# Altium schematic sheet DDR3.SchDoc
size A4
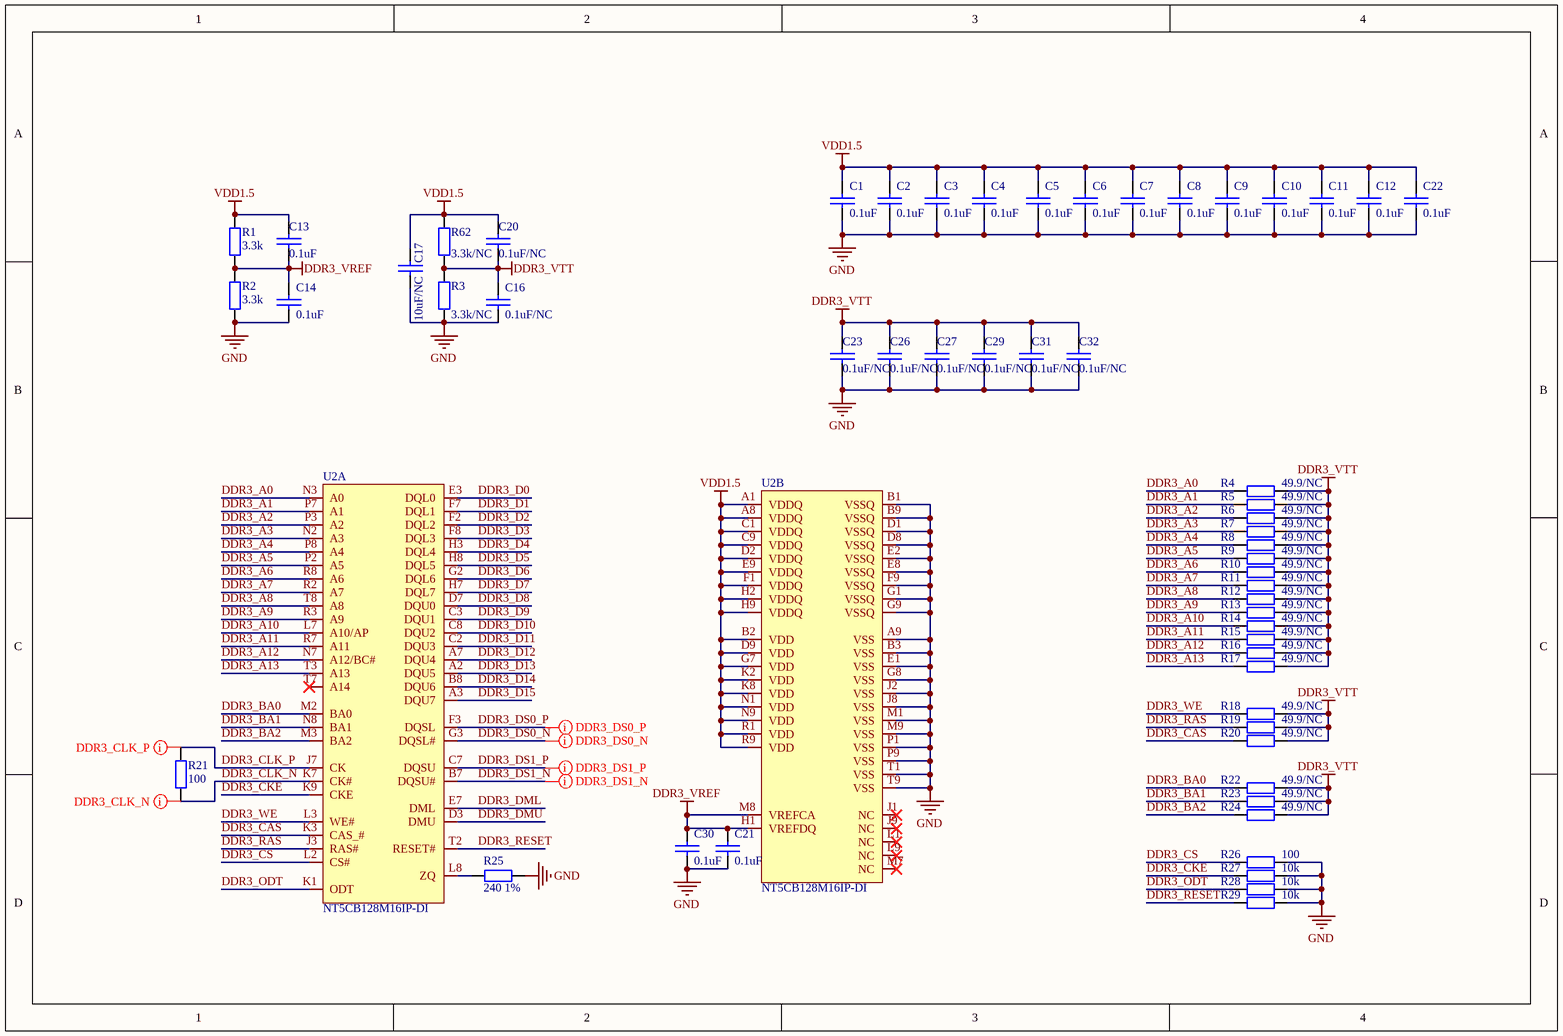
[diagram p0: DDR3.SchDoc]

## Parts
C1  0.1uF  [0402_c_m]
C2  0.1uF  [0402_c_m]
C3  0.1uF  [0402_c_m]
C4  0.1uF  [0402_c_m]
C5  0.1uF  [0402_c_m]
C6  0.1uF  [0402_c_m]
C7  0.1uF  [0402_c_m]
C8  0.1uF  [0402_c_m]
C9  0.1uF  [0402_c_m]
C10  0.1uF  [0402_c_m]
C11  0.1uF  [0402_c_m]
C12  0.1uF  [0402_c_m]
C13  0.1uF  [0402_c_m]
C14  0.1uF  [0402_c_m]
C16  0.1uF/NC  [0402_c_m]
C17  10uF/NC  [0603_c_m]
C20  0.1uF/NC  [0402_c_m]
C21  0.1uF  [0402_c_m]
C22  0.1uF  [0402_c_m]
C23  0.1uF/NC  [0402_c_m]
C26  0.1uF/NC  [0402_c_m]
C27  0.1uF/NC  [0402_c_m]
C29  0.1uF/NC  [0402_c_m]
C30  0.1uF  [0402_c_m]
C31  0.1uF/NC  [0402_c_m]
C32  0.1uF/NC  [0402_c_m]
R1  3.3k  [0402_r_m]
R2  3.3k  [0402_r_m]
R3  3.3k/NC  [0402_r_m]
R4  49.9/NC  [0402_r_m]
R5  49.9/NC  [0402_r_m]
R6  49.9/NC  [0402_r_m]
R7  49.9/NC  [0402_r_m]
R8  49.9/NC  [0402_r_m]
R9  49.9/NC  [0402_r_m]
R10  49.9/NC  [0402_r_m]
R11  49.9/NC  [0402_r_m]
R12  49.9/NC  [0402_r_m]
R13  49.9/NC  [0402_r_m]
R14  49.9/NC  [0402_r_m]
R15  49.9/NC  [0402_r_m]
R16  49.9/NC  [0402_r_m]
R17  49.9/NC  [0402_r_m]
R18  49.9/NC  [0402_r_m]
R19  49.9/NC  [0402_r_m]
R20  49.9/NC  [0402_r_m]
R21  100  [0402_r_m]
R22  49.9/NC  [0402_r_m]
R23  49.9/NC  [0402_r_m]
R24  49.9/NC  [0402_r_m]
R25  240 1%  [0402_R_M]
R26  100  [0402_r_m]
R27  10k  [0402_r_m]
R28  10k  [0402_r_m]
R29  10k  [0402_r_m]
R62  3.3k/NC  [0402_r_m]
U2  NT5CB128M16IP-DI  [TFBGA96]  (parts A,B of 2)

## Nets
DDR3_VREF: C13.2 C14.1 C21.1 C30.1 R1.1 R2.2 U2.H1(VREFDQ) U2.M8(VREFCA)
DDR3_VTT: C16.1 C20.2 C23.1 C26.1 C27.1 C29.1 C31.1 C32.1 R3.2 R4.2 R5.2 R6.2 R7.2 R8.2 R9.2 R10.2 R11.2 R12.2 R13.2 R14.2 R15.2 R16.2 R17.2 R18.2 R19.2 R20.2 R22.2 R23.2 R24.2 R62.1
GND: C1.2 C2.2 C3.2 C4.2 C5.2 C6.2 C7.2 C8.2 C9.2 C10.2 C11.2 C12.2 C14.2 C16.2 C17.2 C21.2 C22.2 C23.2 C26.2 C27.2 C29.2 C30.2 C31.2 C32.2 R2.1 R3.1 R25.1 R26.2 R27.2 R28.2 R29.2 U2.A9(VSS) U2.B1(VSSQ) U2.B3(VSS) U2.B9(VSSQ) U2.D1(VSSQ) U2.D8(VSSQ) U2.E1(VSS) U2.E2(VSSQ) U2.E8(VSSQ) U2.F9(VSSQ) U2.G1(VSSQ) U2.G8(VSS) U2.G9(VSSQ) U2.J2(VSS) U2.J8(VSS) U2.M1(VSS) U2.M9(VSS) U2.P1(VSS) U2.P9(VSS) U2.T1(VSS) U2.T9(VSS)
VDD1.5: C1.1 C2.1 C3.1 C4.1 C5.1 C6.1 C7.1 C8.1 C9.1 C10.1 C11.1 C12.1 C13.1 C17.1 C20.1 C22.1 R1.2 R62.2 U2.A1(VDDQ) U2.A8(VDDQ) U2.B2(VDD) U2.C1(VDDQ) U2.C9(VDDQ) U2.D2(VDDQ) U2.D9(VDD) U2.E9(VDDQ) U2.F1(VDDQ) U2.G7(VDD) U2.H2(VDDQ) U2.H9(VDDQ) U2.K2(VDD) U2.K8(VDD) U2.N1(VDD) U2.N9(VDD) U2.R1(VDD) U2.R9(VDD)
DDR3_A0: R4.1 U2.N3(A0)
DDR3_A1: R5.1 U2.P7(A1)
DDR3_A2: R6.1 U2.P3(A2)
DDR3_A3: R7.1 U2.N2(A3)
DDR3_A4: R8.1 U2.P8(A4)
DDR3_A5: R9.1 U2.P2(A5)
DDR3_A6: R10.1 U2.R8(A6)
DDR3_A7: R11.1 U2.R2(A7)
DDR3_A8: R12.1 U2.T8(A8)
DDR3_A9: R13.1 U2.R3(A9)
DDR3_A10: R14.1 U2.L7(A10/AP)
DDR3_A11: R15.1 U2.R7(A11)
DDR3_A12: R16.1 U2.N7(A12/BC#)
DDR3_A13: R17.1 U2.T3(A13)
DDR3_BA0: R22.1 U2.M2(BA0)
DDR3_BA1: R23.1 U2.N8(BA1)
DDR3_BA2: R24.1 U2.M3(BA2)
DDR3_CAS: R20.1 U2.K3(CAS_#)
DDR3_CKE: R27.1 U2.K9(CKE)
DDR3_CLK_N: R21.1 U2.K7(CK#)
DDR3_CLK_P: R21.2 U2.J7(CK)
DDR3_CS: R26.1 U2.L2(CS#)
DDR3_D0: U2.E3(DQL0)
DDR3_D1: U2.F7(DQL1)
DDR3_D2: U2.F2(DQL2)
DDR3_D3: U2.F8(DQL3)
DDR3_D4: U2.H3(DQL4)
DDR3_D5: U2.H8(DQL5)
DDR3_D6: U2.G2(DQL6)
DDR3_D7: U2.H7(DQL7)
DDR3_D8: U2.D7(DQU0)
DDR3_D9: U2.C3(DQU1)
DDR3_D10: U2.C8(DQU2)
DDR3_D11: U2.C2(DQU3)
DDR3_D12: U2.A7(DQU4)
DDR3_D13: U2.A2(DQU5)
DDR3_D14: U2.B8(DQU6)
DDR3_D15: U2.A3(DQU7)
DDR3_DML: U2.E7(DML)
DDR3_DMU: U2.D3(DMU)
DDR3_DS0_N: U2.G3(DQSL#)
DDR3_DS0_P: U2.F3(DQSL)
DDR3_DS1_N: U2.B7(DQSU#)
DDR3_DS1_P: U2.C7(DQSU)
DDR3_ODT: R28.1 U2.K1(ODT)
DDR3_RAS: R19.1 U2.J3(RAS#)
DDR3_RESET: R29.1 U2.T2(RESET#)
DDR3_WE: R18.1 U2.L3(WE#)
NetR25_2: R25.2 U2.L8(ZQ)

Not connected (* = marked no-connect by the designer): U2 J1(NC)* J9(NC)* L1(NC)* L9(NC)* M7(NC)* T7(A14)*

## Layout directives
differential pair: DDR3_CLK_N, DDR3_CLK_P, DDR3_DS0_N, DDR3_DS0_P, DDR3_DS1_N, DDR3_DS1_P

## Library data of the parts
C1-C14 C16 C17 C20-C23 C26 C27 C29-C32 = CAP
R1-R29 R62 = RES2